# Altium schematic sheet PowerMonitor.SchDoc
size A4; DocumentNumber: 1; SheetNumber: 1
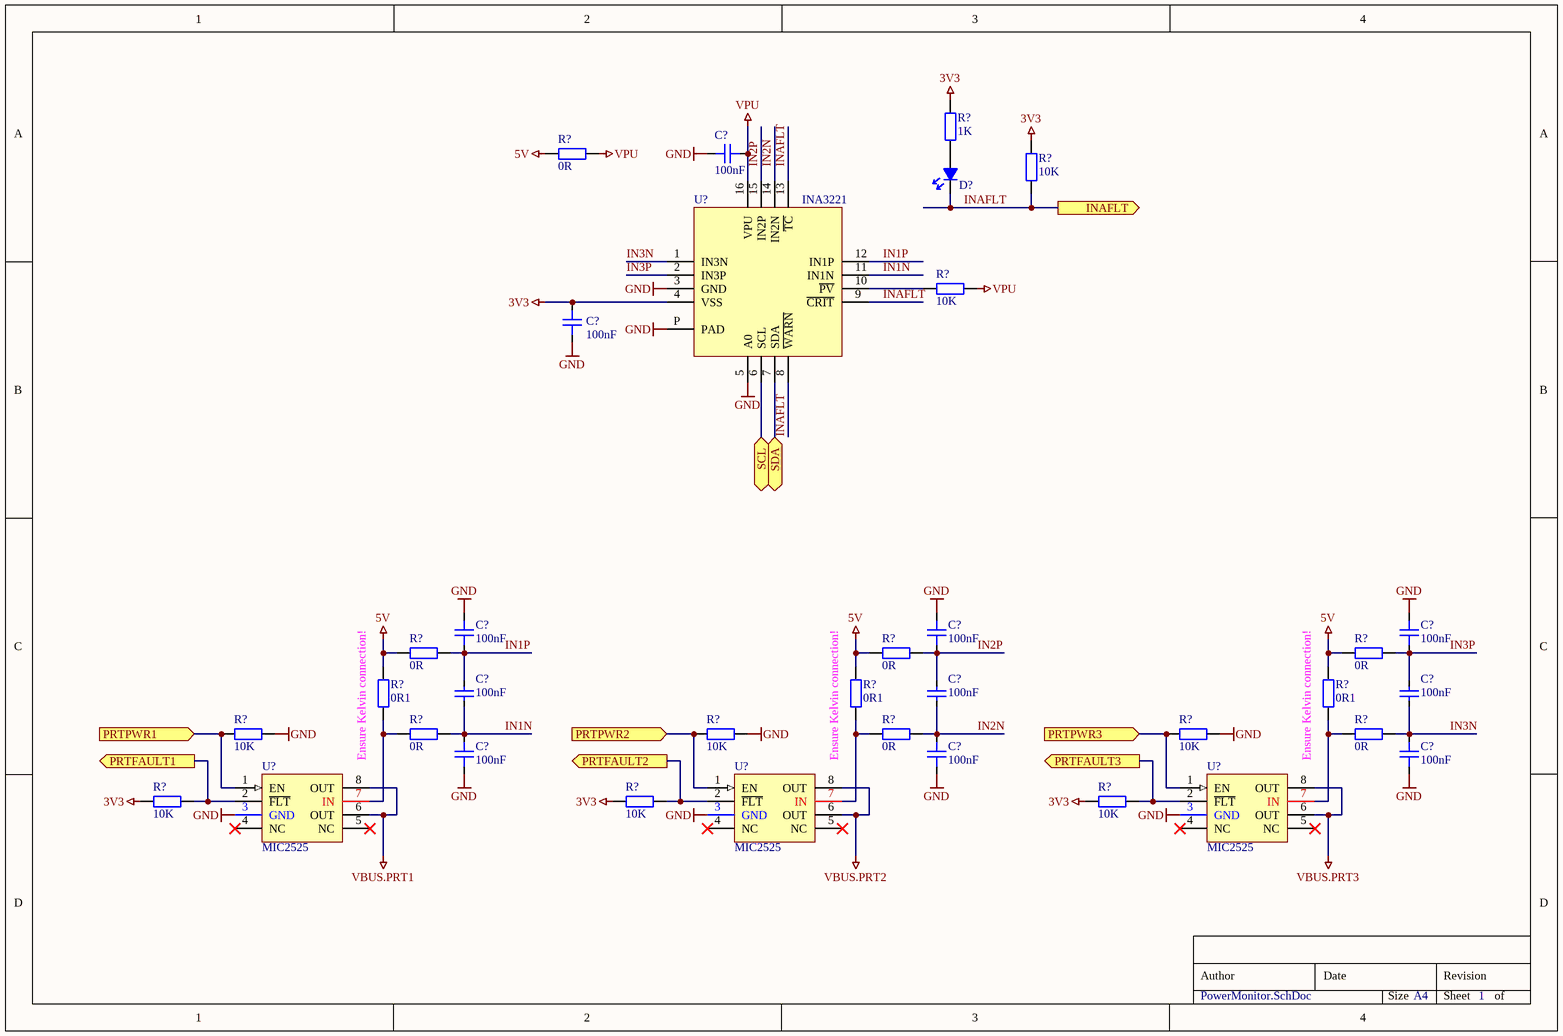
[diagram p0: PowerMonitor.SchDoc]

## Parts
(Parts that share a designator on the sheet are numbered #1, #2 ... from top to bottom, then left to right.)
C?#1  100nF  [0603C_RF_M]
C?#2  100nF  [0603C_RF_M]
C?#3  100nF  [0805C_RF_M]
C?#4  100nF  [0805C_RF_M]
C?#5  100nF  [0805C_RF_M]
C?#6  100nF  [0805C_RF_M]
C?#7  100nF  [0805C_RF_M]
C?#8  100nF  [0805C_RF_M]
C?#9  100nF  [0805C_RF_M]
C?#10  100nF  [0805C_RF_M]
C?#11  100nF  [0805C_RF_M]
D?  Unspecified  [0805LED_RF_M]  (value not drawn)
R?#1  10K  [0805R_RF_M]
R?#2  0R  [0805R_RF_M]
R?#3  1K  [0805R_RF_M]
R?#4  10K  [0805R_RF_M]
R?#5  0R  [0805R_RF_M]
R?#6  0R  [0805R_RF_M]
R?#7  0R  [0805R_RF_M]
R?#8  0R1  [0805R_RF_M]
R?#9  0R1  [0805R_RF_M]
R?#10  0R1  [0805R_RF_M]
R?#11  10K  [0805R_RF_M]
R?#12  0R  [0805R_RF_M]
R?#13  10K  [0805R_RF_M]
R?#14  0R  [0805R_RF_M]
R?#15  10K  [0805R_RF_M]
R?#16  0R  [0805R_RF_M]
R?#17  10K  [0805R_RF_M]
R?#18  10K  [0805R_RF_M]
R?#19  10K  [0805R_RF_M]
U?#1  INA3221
U?#2  MIC2525  [SOIC-8]
U?#3  MIC2525  [SOIC-8]
U?#4  MIC2525  [SOIC-8]

## Ports
INAFLT (out), PRTFAULT1 (out), PRTFAULT2 (out), PRTFAULT3 (out), PRTPWR1 (in), PRTPWR2 (in), PRTPWR3 (in), SCL (bidir), SDA (bidir)

## Nets
3V3: C?#2.2 R?#1.1 R?#3.2 R?#17.1 R?#18.1 R?#19.1 U?#1.4(VSS)
5V: R?#2.1 R?#5.1 R?#6.1 R?#7.1 R?#8.2 R?#9.2 R?#10.2
GND: C?#1.1 C?#2.1 C?#3.2 C?#4.2 C?#5.2 C?#9.1 C?#10.1 C?#11.1 R?#11.1 R?#13.1 R?#15.1 U?#1.3(GND) U?#1.5(A0) U?#1.P(PAD) U?#2.3(GND) U?#3.3(GND) U?#4.3(GND)
VBUS.PRT1: U?#2.6(OUT) U?#2.8(OUT)
VBUS.PRT2: U?#3.6(OUT) U?#3.8(OUT)
VBUS.PRT3: U?#4.6(OUT) U?#4.8(OUT)
VPU: C?#1.2 R?#2.2 R?#4.1 U?#1.16(VPU)
IN1N: C?#6.1 C?#9.2 R?#12.2 U?#1.11(IN1N)
IN1P: C?#3.1 C?#6.2 R?#5.2 U?#1.12(IN1P)
IN2N: C?#7.1 C?#10.2 R?#14.2 U?#1.14(IN2N)
IN2P: C?#4.1 C?#7.2 R?#6.2 U?#1.15(IN2P)
IN3N: C?#8.1 C?#11.2 R?#16.2 U?#1.1(IN3N)
IN3P: C?#5.1 C?#8.2 R?#7.2 U?#1.2(IN3P)
INAFLT: D?.C R?#1.2 U?#1.8(~{WARN}) U?#1.9(~{CRIT}) U?#1.13(~{TC}) ; port INAFLT
PRTFAULT1: R?#17.2 U?#2.2(~{FLT}) ; port PRTFAULT1
PRTFAULT2: R?#18.2 U?#3.2(~{FLT}) ; port PRTFAULT2
PRTFAULT3: R?#19.2 U?#4.2(~{FLT}) ; port PRTFAULT3
PRTPWR1: R?#11.2 U?#2.1(EN) ; port PRTPWR1
PRTPWR2: R?#13.2 U?#3.1(EN) ; port PRTPWR2
PRTPWR3: R?#15.2 U?#4.1(EN) ; port PRTPWR3
SCL: U?#1.6(SCL) ; port SCL
SDA: U?#1.7(SDA) ; port SDA
NetD?_A: D?.A R?#3.1
NetR?#4_2: R?#4.2 U?#1.10(~{PV})
NetR?#8_1: R?#8.1 R?#12.1 U?#2.7(IN)
NetR?#9_1: R?#9.1 R?#14.1 U?#3.7(IN)
NetR?#10_1: R?#10.1 R?#16.1 U?#4.7(IN)

Not connected (* = marked no-connect by the designer): U?#2 4(NC)* 5(NC)*; U?#3 4(NC)* 5(NC)*; U?#4 4(NC)* 5(NC)*

## Notes on the sheet
- (near R?#8) Ensure Kelvin connection!
- (near R?#9) Ensure Kelvin connection!
- (near R?#10) Ensure Kelvin connection!
- Author
- Date
- Revision
- Size
- A4
- Sheet
- of

## Library data of the parts
C?#1-C?#11 = C: Capacitor; Manufacturer: Generic Brand; Max Voltage: ? V; Value: 100nF; Tolerance: ?; Manufacturer Part No: *; Supplier: *; Supplier Link: http://; Supplier Part No: *; Category: Capacitor; Mounting Technology: SMT
  C?#3-C?#11: Tag: *
D? = LED: Manufacturer: Generic Brand; Forward Voltage Drop: ? V; Emitting Color: Unspecified; Manufacturer Part No: *; Supplier: *; Supplier Link: http://; Supplier Part No: *; Category: Diode; Mounting Technology: SMT
R?#1-R?#19 = R: Resistor; Manufacturer: Generic Brand; Power Rating: ? W; Max Voltage: ? V; Tolerance: ?; Supplier Link: http://; Category: Resistor; Mounting Technology: SMT
  R?#1 R?#4 R?#11 R?#13 R?#15 R?#17-R?#19: Value: 10K
  R?#2 R?#5-R?#7 R?#12 R?#14 R?#16: Value: 0R
  R?#3: Value: 1K
  R?#8-R?#10: Value: 0R1
U?#1 = INA3221: IC CURRENT SHUNT MONITOR 16VQFN; Manufacturer: Texas Instruments; Supplier: DigiKey; Supplier Part No: 296-INA3221AIRGVRCT-ND; Supplier Link: https://www.digikey.com/en/products/detail/texas-instruments/INA3221AIRGVR/3588826; Mounting Technology: SMT; Package: VQFN-16; Category: IC
U?#2-U?#4 = MIC2525: USB POWER CONTROL SWITCH; Manufacturer: Micrel Inc.; Product Number: MIC2525-1BM; Supplier: DigiKey; Supplier Link: *; Supplier Part No: *; Mounting Technology: SMT; Package: SOIC-8; Category: IC